# Altium schematic sheet Top.SchDoc
size A; SheetNumber: 3; SheetTotal: 2
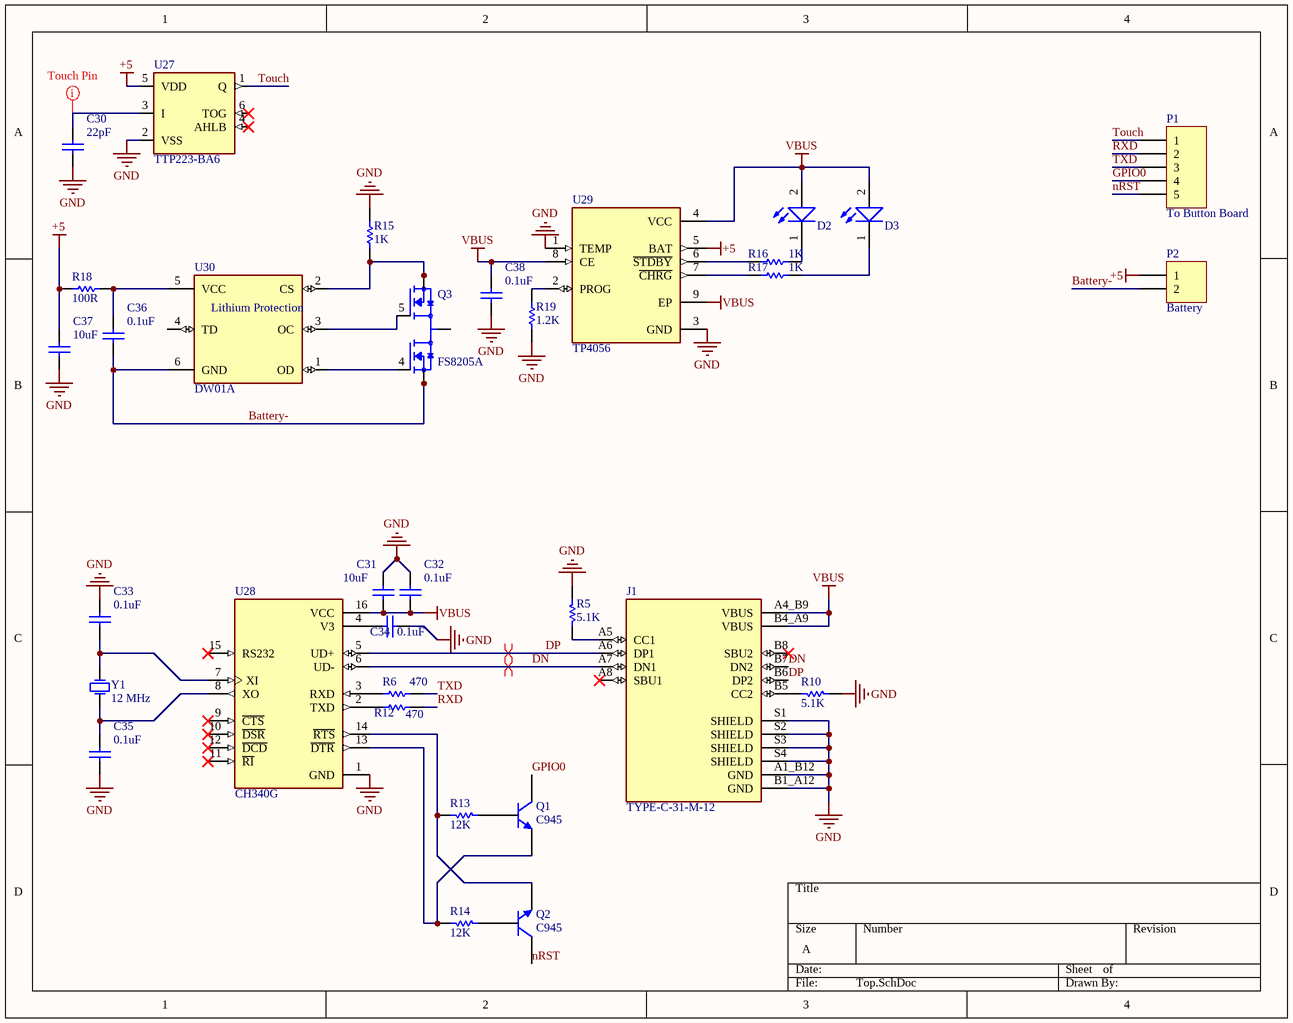
[diagram p0: Top.SchDoc]

## Parts
C30  22pF  [CAPC3413X12N]
C31  10uF  [CAPC3413X12N]
C32  0.1uF  [CAPC3413X12N]
C33  0.1uF  [CAPC3413X12N]
C34  0.1uF  [CAPC3413X12N]
C35  0.1uF  [CAPC3413X12N]
C36  0.1uF  [CAPC3413X12N]
C37  10uF  [CAPC3413X12N]
C38  0.1uF  [CAPC3413X12N]
D2  LED SMD PACKAGE  [LED_SMD_0805]  (value not drawn)
D3  LED SMD PACKAGE  [LED_SMD_0805]  (value not drawn)
J1  TYPE-C-31-M-12  [HRO_TYPE-C-31-M-12]
P1  To Button Board  [HDR1X5]
P2  Battery  [HDR1X2]
Q1  C945  [SOT23_N]
Q2  C945  [SOT23_N]
Q3  FS8205A  [SOP65P640X120-8N]
R5  5.1K  [RES0805]
R6  470  [RES0805]
R10  5.1K  [RES0805]
R12  470  [RES0805]
R13  12K  [RES0805]
R14  12K  [RES0805]
R15  1K  [RESC3413X04N]
R16  1K  [RESC3413X04N]
R17  1K  [RESC3413X04N]
R18  100R  [RESC3413X04N]
R19  1.2K  [RESC3413X04N]
U27  TTP223-BA6  [SOT23-6]
U28  CH340G  [SOIC127P600X180-16N]
U29  TP4056  [SOP127P600X175-9N]
U30  DW01A  [SOT23-6]
Y1  12 MHz  [Crystal SMD]

## Nets
+5: C37.1 P2.1 R18.1 U27.5(VDD) U29.5(BAT)
GND: C30.2 C31.1 C32.1 C33.1 C34.1 C35.2 C37.2 C38.2 J1.A1_B12(GND) J1.B1_A12(GND) J1.S1(SHIELD) J1.S2(SHIELD) J1.S3(SHIELD) J1.S4(SHIELD) R5.1 R10.1 R15.1 R19.1 U27.2(VSS) U28.1(GND) U29.1(TEMP) U29.3(GND)
VBUS: C31.2 C32.2 C38.1 D2.2(A) D3.2(A) J1.A4_B9(VBUS) J1.B4_A9(VBUS) U28.16(VCC) U29.4(VCC) U29.8(CE) U29.9(EP)
Battery-: C36.2 P2.2 Q3.2(S1) Q3.3(S1) U30.6(GND)
DN: J1.A7(DN1) J1.B7(DN2) U28.6(UD-)
DP: J1.A6(DP1) J1.B6(DP2) U28.5(UD+)
GPIO0: P1.4 Q1.3(C)
nRST: P1.5 Q2.3(C)
RXD: P1.2 R12.2
Touch: P1.1 U27.1(Q)
TXD: P1.3 R6.2
NetC30_1: C30.1 U27.3(I)
NetC33_2: C33.2 U28.7(XI) Y1.2(OSC2)
NetC34_2: C34.2 U28.4(V3)
NetC35_1: C35.1 U28.8(XO) Y1.1(OSC1)
NetC36_1: C36.1 R18.2 U30.5(VCC)
NetD2_1: D2.1(K) R16.2
NetD3_1: D3.1(K) R17.2
NetJ1_A5: J1.A5(CC1) R5.2
NetJ1_B5: J1.B5(CC2) R10.2
NetQ1_1: Q1.1(B) R13.2
NetQ1_2: Q1.2(E) R14.1 U28.13(~{DTR})
NetQ2_1: Q2.1(B) R14.2
NetQ2_2: Q2.2(E) R13.1 U28.14(~{RTS})
NetQ3_1: Q3.1(D12) Q3.8(D12)
NetQ3_4: Q3.4(G1) U30.1(OD)
NetQ3_5: Q3.5(G2) U30.3(OC)
NetQ3_6: Q3.6(S2) Q3.7(S2) R15.2 U30.2(CS)
NetR6_1: R6.1 U28.3(RXD)
NetR12_1: R12.1 U28.2(TXD)
NetR16_1: R16.1 U29.6(~{STDBY})
NetR17_1: R17.1 U29.7(~{CHRG})
NetR19_2: R19.2 U29.2(PROG)

Not connected (* = marked no-connect by the designer): J1 A8(SBU1)* B8(SBU2)*; U27 4(AHLB)* 6(TOG)*; U28 9(~{CTS})* 10(~{DSR})* 11(~{RI})* 12(~{DCD})* 15(RS232)*; U30 4(TD)

## Layout directives
differential pair: DN, DP
mark named Touch Pin: NetC30_1

## Notes on the sheet
- (in symbol DW01A) Lithium Protection

## Library data of the parts
C30-C38 = CAP SMD 0805: CAP 0805; Designer: Abbas Basereh; Desc.: CAP SMD 0805; Data: 16-12-2016
D2 D3 = LED SMD PACKAGE: SMD Mono-color Chip LED Waterclear; Part Number: 150080BS75000; Peak Wavelength: 465 nm; Forward Voltage: 3.2 V; Published Date: Jan 2017; Publisher: Ali Hafizi
J1 = TYPE-C-31-M-12: USB Connectors 24 Receptacle 1 8.94*7.3mm RoHS; MF: HRO Electronics Co., Ltd.; Price: None; Value: *; SnapEDA_Link: https://www.snapeda.com/parts/TYPE-C-31-M-12/HRO+Electronics+Co.%252C+Ltd./view-part/?ref=snap; Package: Package; Availability: Not in stock; Check_prices: https://www.snapeda.com/parts/TYPE-C-31-M-12/HRO+Electronics+Co.%252C+Ltd./view-part/?ref=eda; MP: TYPE-C-31-M-12
P1 = Header 5: Header, 5-Pin; LatestRevisionDate: 17-Jul-2002; LatestRevisionNote: Re-released for DXP Platform.; Publisher: Altium Limited
P2 = Header 2: Header, 2-Pin; LatestRevisionDate: 17-Jul-2002; LatestRevisionNote: Re-released for DXP Platform.; Publisher: Altium Limited
Q1 Q2 = C945: NPN Silicon Epitaxial Planar Transistor; Published: 2017-2-8; LatestRevisionDate: 2017; LatestRevisionNote: IPC-7351 Footprint Added.; DatasheetVersion: 2017; PackageVersion: 2017-2-8; PackageReference: SOT23; Publisher: Abbas Basereh; PackageDescription: 3-Pin SOT-23 Package 0.95 mm Pitch, 2.3 mm Lead Span; ComponentLink1Description: Manufacturer Link; ComponentLink1URL: http://www.taitroncomponents.com/; ComponentLink2Description: Datasheet; ComponentLink2URL: http://www.taitroncomponents.com/
Q3 = FS8205A: N/A; MF: Fortune Semiconductor; MP: FS8205A; Value: *; Availability: Not in stock; Package: Package; Price: None; SnapEDA_Link: https://www.snapeda.com/parts/FS8205A/Fortune+Semiconductor/view-part/?ref=snap; Check_prices: https://www.snapeda.com/parts/FS8205A/Fortune+Semiconductor/view-part/?ref=eda
R5 R6 R10 R12-R14 = RES SMD PACKAGE: TOTAL SMD RESISTOR PACK; Designer: Abbas Basereh; Desc.: RES SMD PAKAGES; Data: 2017-3-10
R15-R19 = RES 0805 0.125W: RES 0805; Designer: Abbas Basereh; Desc.: RES SMD 0805; Data: 16-12-2016
U27 = TTP223-BA6: <b>DÃ©tecteur</b> de Touches Tactiles IC<p> Doc constructeur <a href="http://geii/magasin/pdf/TTP223-BA6.pdf" title="Enlarge picture"> <img src="http://geii/magasin/images/pdf.jpg"></a><p> <b>GEII/IUT ANGERS</b>; MF: tontek; Value: *; SnapEDA_Link: https://www.snapeda.com/parts/TTP223-BA6/TONTEK/view-part/?ref=snap; Price: None; Availability: Not in stock; Package: None; MP: TTP223-BA6; Check_prices: https://www.snapeda.com/parts/TTP223-BA6/TONTEK/view-part/?ref=eda
U28 = CH340G: USB Interface Integrated Circuit; MF: WCH; Value: *; SnapEDA_Link: https://www.snapeda.com/parts/Ch340G/WCH/view-part/?ref=snap; MP: Ch340G; Check_prices: https://www.snapeda.com/parts/Ch340G/WCH/view-part/?ref=eda; Availability: Not in stock; Price: None; Package: None
U29 = TP4056: Complete single cell Li-Ion battery with a constant current / constant voltage linear charger; MF: NanJing Top Power ASIC Corp.; Check_prices: https://www.snapeda.com/parts/TP4056/NanJing+Top+Power+ASIC+Corp./view-part/?ref=eda; SnapEDA_Link: https://www.snapeda.com/parts/TP4056/NanJing+Top+Power+ASIC+Corp./view-part/?ref=snap; Price: None; Availability: Not in stock; Package: Package; MP: TP4056; Value: *
U30 = DW01A: One Cell Lithium-ion/Polymer Battery Protection IC; MF: Fortune Semiconductor; SnapEDA_Link: https://www.snapeda.com/parts/DW01A/Fortune+Semiconductor/view-part/?ref=snap; Package: SOT-23-6 Fortune Semiconductor; Value: *; MP: DW01A; Check_prices: https://www.snapeda.com/parts/DW01A/Fortune+Semiconductor/view-part/?ref=eda
Y1 = XTAL: XTAL Crystal; Designer: ABBAS BASEREH; Design Date: 2017-1-3; ComponentLink1Description: Datasheet; ComponentLink2Description: Reference; Mounting Technology: Surface Mount\Through-Hole; Value: 12 MHz; Status: Unreleased